# Altium schematic sheet Power_Management.SchDoc
size A; SheetNumber: 1; SheetTotal: 1
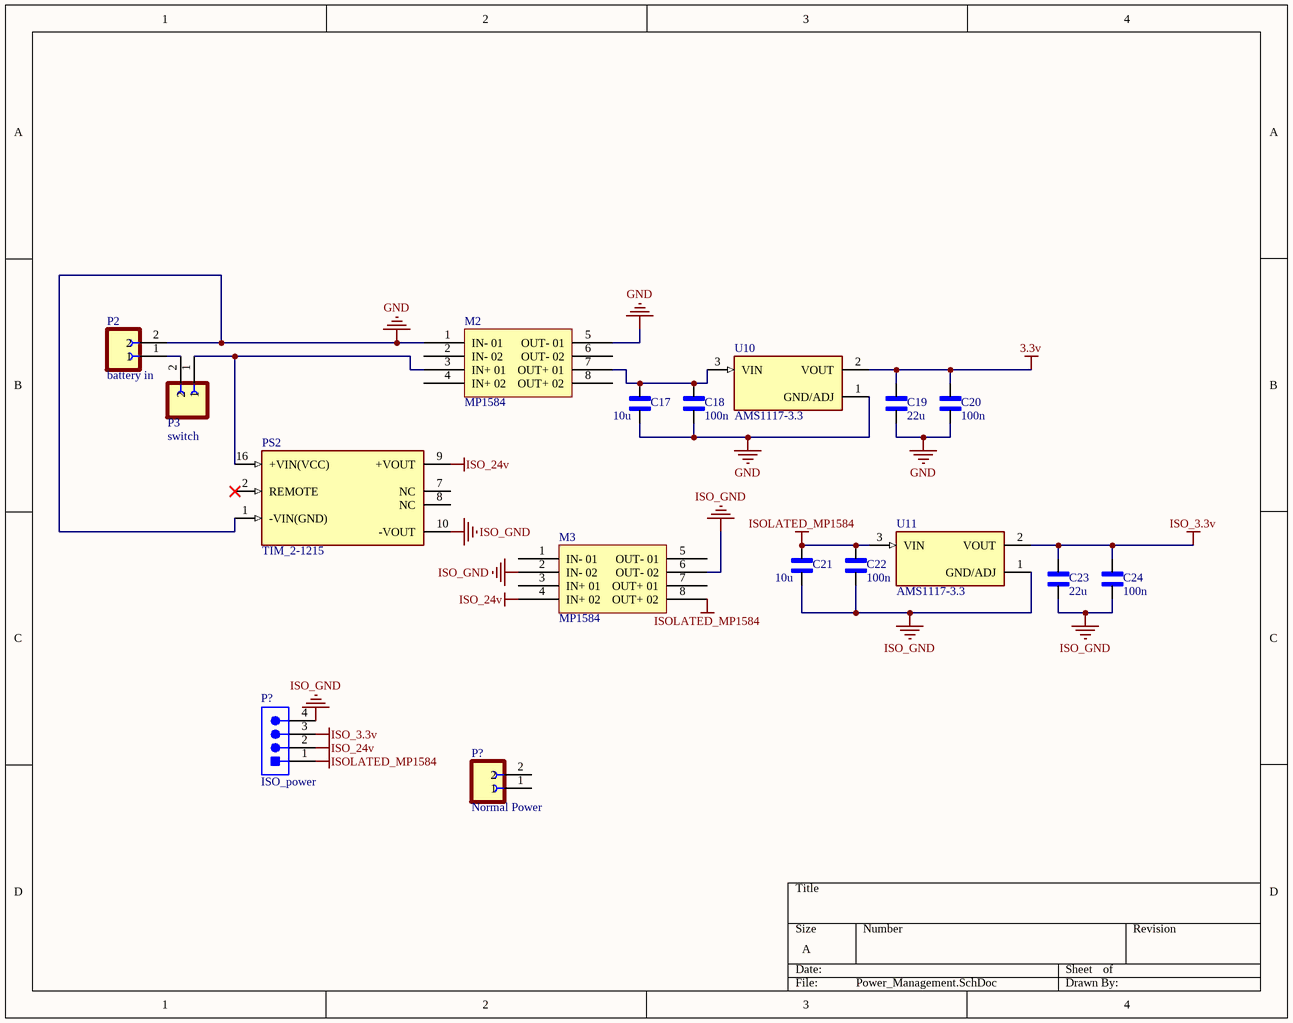
[diagram p0: Power_Management.SchDoc]

## Parts
(Parts that share a designator on the sheet are numbered #1, #2 ... from top to bottom, then left to right.)
C17  10u  [RESC3216X125N]
C18  100n  [CAPC1608X90]
C19  22u  [RESC3216X125N]
C20  100n  [CAPC1608X90]
C21  10u  [RESC3216X125N]
C22  100n  [CAPC1608X90]
C23  22u  [RESC3216X125N]
C24  100n  [CAPC1608X90]
M2  MP1584  [PCBComponent_1]
M3  MP1584  [PCBComponent_1]
P2  battery in  [JST_PHR-2]
P3  switch  [JST_PHR-2]
P?#1  ISO_power  [JST-S4B-XH-A(LF)(SN)_V]
P?#2  Normal Power  [JST_PHR-2]
PS2  TIM_2-1215  [CONV_TIM_2-1215]
U10  AMS1117-3.3  [SOT229P700X180-4N]
U11  AMS1117-3.3  [SOT229P700X180-4N]

## Nets
3.3v: C19.2 C20.1 U10.2(VOUT)
GND: C17.1 C18.2 C19.1 C20.2 M2.1(IN-_01) M2.5(OUT-_01) P2.2 PS2.1(-VIN(GND)) U10.1(GND/ADJ)
ISO_3.3v: C23.2 C24.1 P?#1.3 U11.2(VOUT)
ISO_24v: M3.4(IN+_02) P?#1.2 PS2.9(+VOUT)
ISO_GND: C21.1 C22.2 C23.1 C24.2 M3.2(IN-_02) M3.6(OUT-_02) P?#1.4 PS2.10(-VOUT) U11.1(GND/ADJ)
ISOLATED_MP1584: C21.2 C22.1 M3.8(OUT+_02) P?#1.1 U11.3(VIN)
NetC17_2: C17.2 C18.1 M2.7(OUT+_01) U10.3(VIN)
NetM2_3: M2.3(IN+_01) P3.1 PS2.16(+VIN(VCC))
NetP2_1: P2.1 P3.2

Not connected (* = marked no-connect by the designer): M2 2(IN-_02) 4(IN+_02) 6(OUT-_02) 8(OUT+_02); M3 1(IN-_01) 3(IN+_01) 5(OUT-_01) 7(OUT+_01); P?#2 1 2; PS2 2(REMOTE)* 7(NC) 8(NC)

## Library data of the parts
C17 C19 C21 C23 = T491A106K016AT: Capacitors Tantalum PCB 10uF SMD Tol 10% 16 VDC Case Size 3216 T491 Series | KEMET T491A106K016AT; SnapEDA_Link: https://www.snapeda.com/parts/T491A106K016AT/KEMET/view-part/?ref=snap; Package: SMD-2 KEMET; Value: *; MF: KEMET; MP: T491A106K016AT; Check_prices: https://www.snapeda.com/parts/T491A106K016AT/KEMET/view-part/?ref=eda
C18 C20 C22 C24 = C0603KRX7R9BB102: 0603 1 nF 50 V Â±10 % Tolerance X7R Surface Mount Ceramic Capacitor; MF: Yageo; SnapEDA_Link: https://www.snapeda.com/parts/C0603KRX7R9BB102/Yageo/view-part/?ref=snap; Package: 0603 Yageo; Value: *; MP: C0603KRX7R9BB102; Check_prices: https://www.snapeda.com/parts/C0603KRX7R9BB102/Yageo/view-part/?ref=eda
M2 M3 = Component_1
P2 P3 P?#2 = PHR-2: PH Series 2 Position 2 mm Pitch Free Hanging Housing Connector; Value: *; MP: PHR-2; Package: None; Availability: Unavailable; Price: None
P?#1 = CMP-1755-00007-1: Male Header, Pitch 2.5 mm, 1 x 4 Position, Height 6.1 mm, Tail Length 3.4 mm, -25 to 85 degC, RoHS, Bulk; PackageReference: S4B-XH-A(LF)(SN); ComponentLink1Description: Manufacturer URL; DatasheetVersion: May-16; ComponentLink2Description: Datasheet; ComponentLink2URL: http://www.jst-mfg.com/product/pdf/eng/eXH.pdf; ComponentLink1URL: http://www.jst.com/home2.html; PackageDescription: Male Header, Pitch 2.5 mm, 1 x 4 Position, Height 6.1 mm, Tail Length 3.4 mm
U10 U11 = AMS1117-3.3: Sot223/Pkg 1-Amp 3.3-Volt Low Drop Out Voltage Regulatator; MF: Advanced Monolithic Systems; SnapEDA_Link: https://www.snapeda.com/parts/AMS1117-3.3/Advanced+Monolithic+Systems/view-part/?ref=snap; Package: SOT-223 Seeed Technology; Value: *; MP: AMS1117-3.3; Check_prices: https://www.snapeda.com/parts/AMS1117-3.3/Advanced+Monolithic+Systems/view-part/?ref=eda
PS2 = TIM_2-1215: Value: *; MP: TIM_2-1215; Price: None; Package: None; Availability: Unavailable